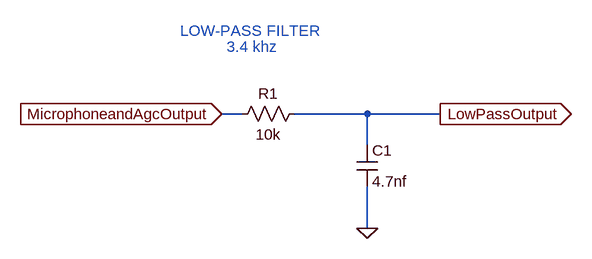
[diagram p0: schematic Draft2.asc]
Draft2.asc, the LTspice schematic file:
Version 4
SHEET 1 880 680
WIRE 96 128 64 128
WIRE 288 128 176 128
WIRE 400 128 288 128
WIRE 288 176 288 128
WIRE 288 304 288 240
FLAG 288 304 0
FLAG 64 128 MicrophoneandAgcOutput
IOPIN 64 128 In
FLAG 400 128 LowPassOutput
IOPIN 400 128 Out
SYMBOL res 192 112 R90
WINDOW 0 0 56 VBottom 2
WINDOW 3 32 56 VTop 2
SYMATTR InstName R1
SYMATTR Value 10k
SYMBOL cap 272 176 R0
SYMATTR InstName C1
SYMATTR Value 4.7nf
TEXT 0 0 Left 2 ;LOW-PASS FILTER
TEXT 72 24 Left 2 ;3.4 khz

The netlist it stands for:
* Draft2.asc
R1 LowPassOutput MicrophoneandAgcOutput 10k
C1 LowPassOutput 0 4.7nf
* LOW-PASS FILTER
* 3.4 khz
.backanno
.end